# Altium schematic sheet 单路.SchDoc
size A3
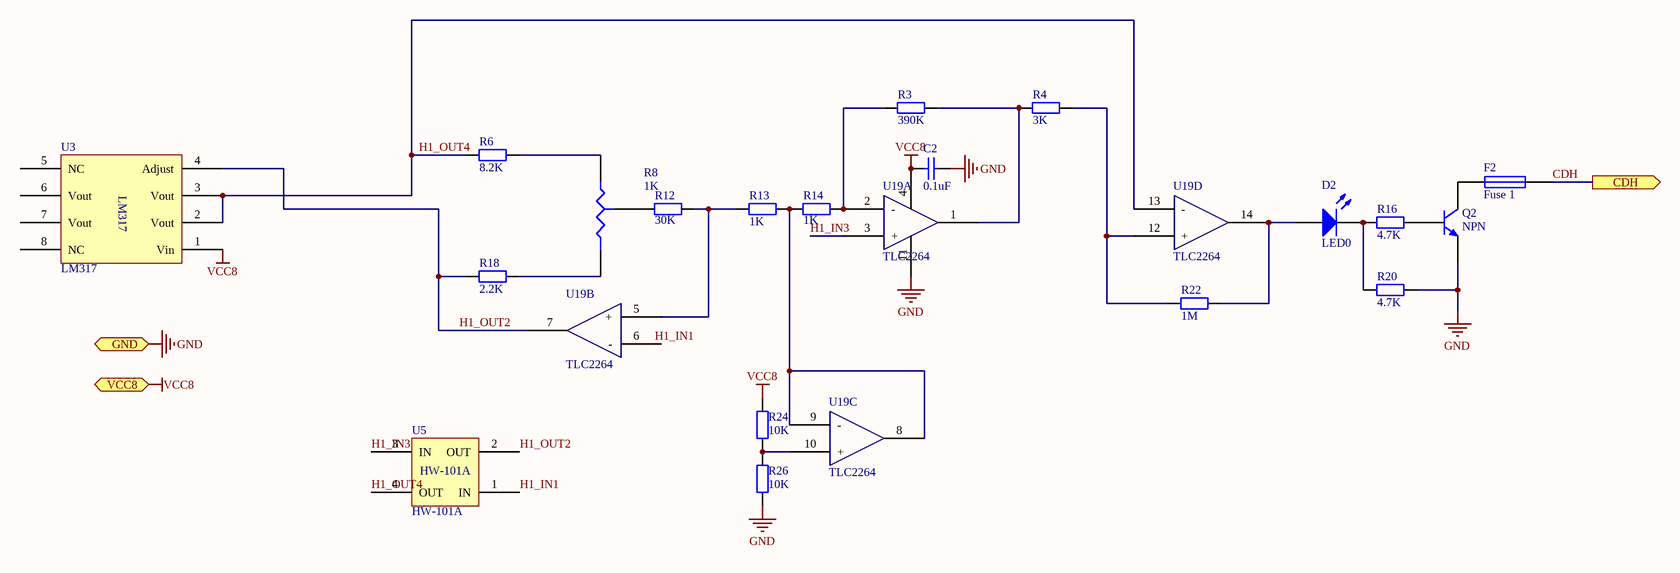
[diagram p0: 单路.SchDoc]

## Parts
C2  value 0.1uF  [C0805]  (hidden comment: Cap Semi)
D2  LED0  [LED1]
F2  Fuse 1  [1206]
Q2  NPN  [SOT-23]
R3  value 390K  [0805]  (hidden comment: Res2)
R4  value 3K  [0805]  (hidden comment: Res2)
R6  value 8.2K  [0805]  (hidden comment: Res2)
R8  value 1K  [3224W]  (hidden comment: Res Tap)
R12  value 30K  [0805]  (hidden comment: Res2)
R13  value 1K  [0805]  (hidden comment: Res2)
R14  value 1K  [0805]  (hidden comment: Res2)
R16  value 4.7K  [0805]  (hidden comment: Res2)
R18  value 2.2K  [0805]  (hidden comment: Res2)
R20  value 4.7K  [0805]  (hidden comment: Res2)
R22  value 1M  [0805]  (hidden comment: Res2)
R24  value 10K  [0805]  (hidden comment: Res2)
R26  value 10K  [0805]  (hidden comment: Res2)
U3  LM317  [SO-8]
U5  HW-101A  [SOT-23-4]
U19  TLC2264  [TSSOP14]  (parts A,B,C,D of 4)

## Ports
CDH (out), GND (bidir), VCC8 (bidir)

## Nets
GND: C2.1 Q2.3(E) R20.2 R26.1 U19.11(GND) ; port GND
VCC8: C2.2 R24.2 U3.1(Vin) U19.4(VCC) ; port VCC8
CDH: F2.2 ; port CDH
H1_IN1: U5.1(IN)
H1_IN3: U5.3(IN) U19.3(+)
H1_OUT2: R18.1 U3.4(Adjust) U5.2(OUT) U19.7(2OUT)
H1_OUT4: R6.1 U3.2(Vout) U3.3(Vout) U5.4(OUT) U19.13(-)
NetD2_1: D2.1(A) R22.2 U19.14(4OUT)
NetD2_2: D2.2(K) R16.1 R20.1
NetF2_1: F2.1 Q2.1(C)
NetQ2_2: Q2.2(B) R16.2
NetR3_1: R3.1 R14.1 U19.2(-)
NetR3_2: R3.2 R4.1 U19.1(1OUT)
NetR4_2: R4.2 R22.1 U19.12(+)
NetR6_2: R6.2 R8.1(A)
NetR8_2: R8.2(B) R18.2
NetR8_3: R8.3(TAP) R12.1
NetR12_2: R12.2 R13.1 U19.5(+)
NetR13_2: R13.2 R14.2 U19.8(3OUT) U19.9(-)
NetR24_1: R24.1 R26.2 U19.10(+)

Not connected (* = marked no-connect by the designer): U3 5(NC) 6(Vout) 7(Vout) 8(NC); U19 6(-)

## Notes on the sheet
- Labels drawn without touching a wire or pin: H1_IN1

## Library data of the parts
C2 = Cap Semi: Capacitor (Semiconductor SIM Model); Published: 8-Jun-2000; LatestRevisionDate: 29-May-2009; LatestRevisionNote: IPC-7351 Footprint Added.; PackageReference: C1206; Publisher: Altium Limited; PackageDescription: Chip Capacitor
D2 = LED0: Typical INFRARED GaAs LED; Published: 8-Jun-2000; LatestRevisionDate: 08-Jul-2005; LatestRevisionNote: Mech Layer 1 removed.; PackageReference: LED-0; Publisher: Altium Limited; PackageDescription: LED; 2 Leads
F2 = Fuse 1: Fuse; Published: 8-Jun-2000; LatestRevisionDate: 17-Jul-2002; LatestRevisionNote: Re-released for DXP Platform.; PackageReference: PIN-W2/E2.8; Publisher: Altium Limited; PackageDescription: Thru-Hole; 2 Leads
Q2 = NPN: NPN Bipolar Transistor; Published: 8-Jun-2000; LatestRevisionDate: 17-Jul-2002; LatestRevisionNote: Re-released for DXP Platform.; PackageReference: TO-226-AA; Publisher: Altium Limited; PackageDescription: TO, Flat Index; 3 In-Line, Axial Leads; Body Dia. 4.8mm; Leads 0.55 x 0.51 mm (max); Code_JEDEC: TO-226-AA
R3 R4 R6 R12-R14 R16 R18 R20 R22 R24 R26 = Res2: Resistor; Published: 8-Jun-2000; LatestRevisionDate: 17-Jul-2002; LatestRevisionNote: Re-released for DXP Platform.; PackageReference: AXIAL-0.4; Publisher: Altium Limited; PackageDescription: Axial Device, Thru-Hole; 2 Leads; 0.4 in Pin Spacing
R8 = Res Tap: Tapped Resistor; Sim Note: Enter the Resistance value and the set point into parameter fields.; Set Position: 0.5; Published: 24-Mar-1999; LatestRevisionDate: 17-Jul-2002; LatestRevisionNote: Re-released for DXP Platform.; PackageReference: VR3; Publisher: Altium Limited; PackageDescription: Variable Resistor, Thru-Hole; 3 Leads